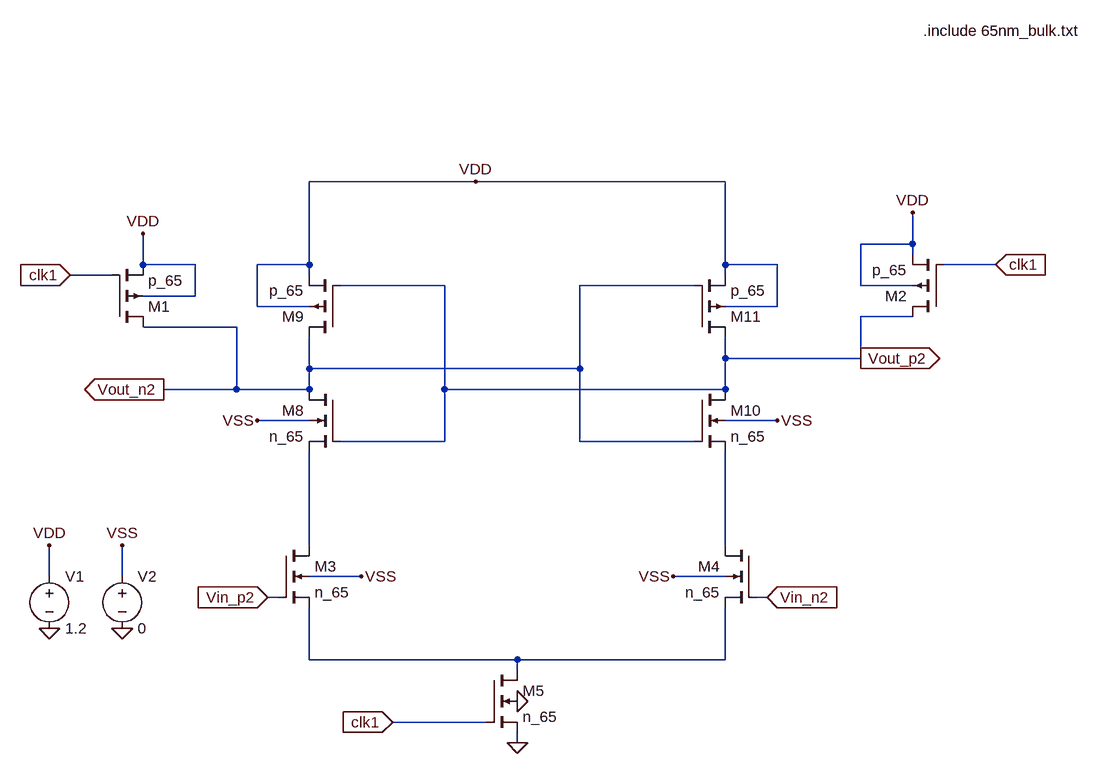
[diagram p0: schematic dyn_comp.asc]
dyn_comp.asc, the LTspice schematic file:
Version 4
SHEET 1 1516 1280
WIRE 400 -48 144 -48
WIRE 784 -48 400 -48
WIRE 1072 48 1072 0
WIRE 1072 48 992 48
WIRE 1072 64 1072 48
WIRE -112 80 -112 32
WIRE -32 80 -112 80
WIRE 144 80 144 -48
WIRE 144 80 64 80
WIRE 784 80 784 -48
WIRE 864 80 784 80
WIRE 1200 80 1120 80
WIRE -160 96 -224 96
WIRE 144 96 144 80
WIRE 784 96 784 80
WIRE 352 112 192 112
WIRE 736 112 560 112
WIRE 992 112 992 48
WIRE 1072 112 992 112
WIRE -32 128 -32 80
WIRE -32 128 -112 128
WIRE 64 144 64 80
WIRE 144 144 64 144
WIRE 864 144 864 80
WIRE 864 144 784 144
WIRE 1072 160 992 160
WIRE 32 176 -112 176
WIRE 784 224 784 192
WIRE 992 224 992 160
WIRE 992 224 784 224
WIRE 144 240 144 192
WIRE 560 240 560 112
WIRE 560 240 144 240
WIRE 32 272 32 176
WIRE 32 272 -80 272
WIRE 144 272 144 240
WIRE 144 272 32 272
WIRE 352 272 352 112
WIRE 784 272 784 224
WIRE 784 272 352 272
WIRE 144 320 64 320
WIRE 864 320 784 320
WIRE 352 352 352 272
WIRE 352 352 192 352
WIRE 560 352 560 240
WIRE 736 352 560 352
WIRE 144 512 144 368
WIRE 784 512 784 368
WIRE -256 560 -256 512
WIRE -144 560 -144 512
WIRE 224 560 144 560
WIRE 784 560 704 560
WIRE 96 592 80 592
WIRE 848 592 832 592
WIRE 144 688 144 608
WIRE 464 688 144 688
WIRE 784 688 784 608
WIRE 784 688 464 688
WIRE 464 704 464 688
WIRE 416 784 272 784
WIRE 464 816 464 800
FLAG -256 640 0
FLAG -256 512 VDD
FLAG -144 640 0
FLAG -144 512 VSS
FLAG -112 32 VDD
FLAG 1072 0 VDD
FLAG -224 96 clk1
IOPIN -224 96 In
FLAG 1200 80 clk1
IOPIN 1200 80 In
FLAG 272 784 clk1
IOPIN 272 784 In
FLAG 848 592 Vin_n2
IOPIN 848 592 In
FLAG 80 592 Vin_p2
IOPIN 80 592 In
FLAG 464 816 0
FLAG 704 560 VSS
FLAG 224 560 VSS
FLAG 464 752 0
FLAG 400 -48 VDD
FLAG 64 320 VSS
FLAG 864 320 VSS
FLAG -80 272 Vout_n2
IOPIN -80 272 Out
FLAG 992 224 Vout_p2
IOPIN 992 224 Out
SYMBOL Voltage -256 544 R0
SYMATTR InstName V1
SYMATTR Value 1.2
SYMBOL Voltage -144 544 R0
SYMATTR InstName V2
SYMATTR Value 0
SYMBOL pmos4 -160 176 M180
SYMATTR InstName M1
SYMATTR Value p_65
SYMATTR Value2 l=65n w=1u
SYMBOL pmos4 1120 160 R180
SYMATTR InstName M2
SYMATTR Value p_65
SYMATTR Value2 l=65n w=1u
SYMBOL nmos4 96 512 R0
SYMATTR InstName M3
SYMATTR Value n_65
SYMATTR Value2 l=0.1u w=10u
SYMBOL nmos4 832 512 M0
SYMATTR InstName M4
SYMATTR Value n_65
SYMATTR Value2 l=0.1u w=10u
SYMBOL nmos4 416 704 R0
SYMATTR InstName M5
SYMATTR Value n_65
SYMATTR Value2 l=1u w=20u
SYMBOL nmos4 192 272 M0
SYMATTR InstName M8
SYMATTR Value n_65
SYMATTR Value2 l=65n w=0.8u
SYMBOL pmos4 192 192 R180
SYMATTR InstName M9
SYMATTR Value p_65
SYMATTR Value2 l=65n w=1.6u
SYMBOL nmos4 736 272 R0
SYMATTR InstName M10
SYMATTR Value n_65
SYMATTR Value2 l=65n w=0.8u
SYMBOL pmos4 736 192 M180
SYMATTR InstName M11
SYMATTR Value p_65
SYMATTR Value2 l=65n w=1.6u
TEXT 1088 -280 Left 2 !.include 65nm_bulk.txt

The netlist it stands for:
* dyn_comp.asc
V1 VDD 0 1.2
V2 VSS 0 0
M1 Vout_n2 clk1 VDD VDD p_65 l=65n w=1u
M2 Vout_p2 clk1 VDD VDD p_65 l=65n w=1u
M3 N001 Vin_p2 N003 VSS n_65 l=0.1u w=10u
M4 N002 Vin_n2 N003 VSS n_65 l=0.1u w=10u
M5 N003 clk1 0 0 n_65 l=1u w=20u
M8 Vout_n2 Vout_p2 N001 VSS n_65 l=65n w=0.8u
M9 Vout_n2 Vout_p2 VDD VDD p_65 l=65n w=1.6u
M10 Vout_p2 Vout_n2 N002 VSS n_65 l=65n w=0.8u
M11 Vout_p2 Vout_n2 VDD VDD p_65 l=65n w=1.6u
.model NMOS NMOS
.model PMOS PMOS
.lib standard.mos
.include 65nm_bulk.txt
.backanno
.end